# Altium schematic sheet Power.SchDoc
size A4; SheetNumber: 1; SheetTotal: 2
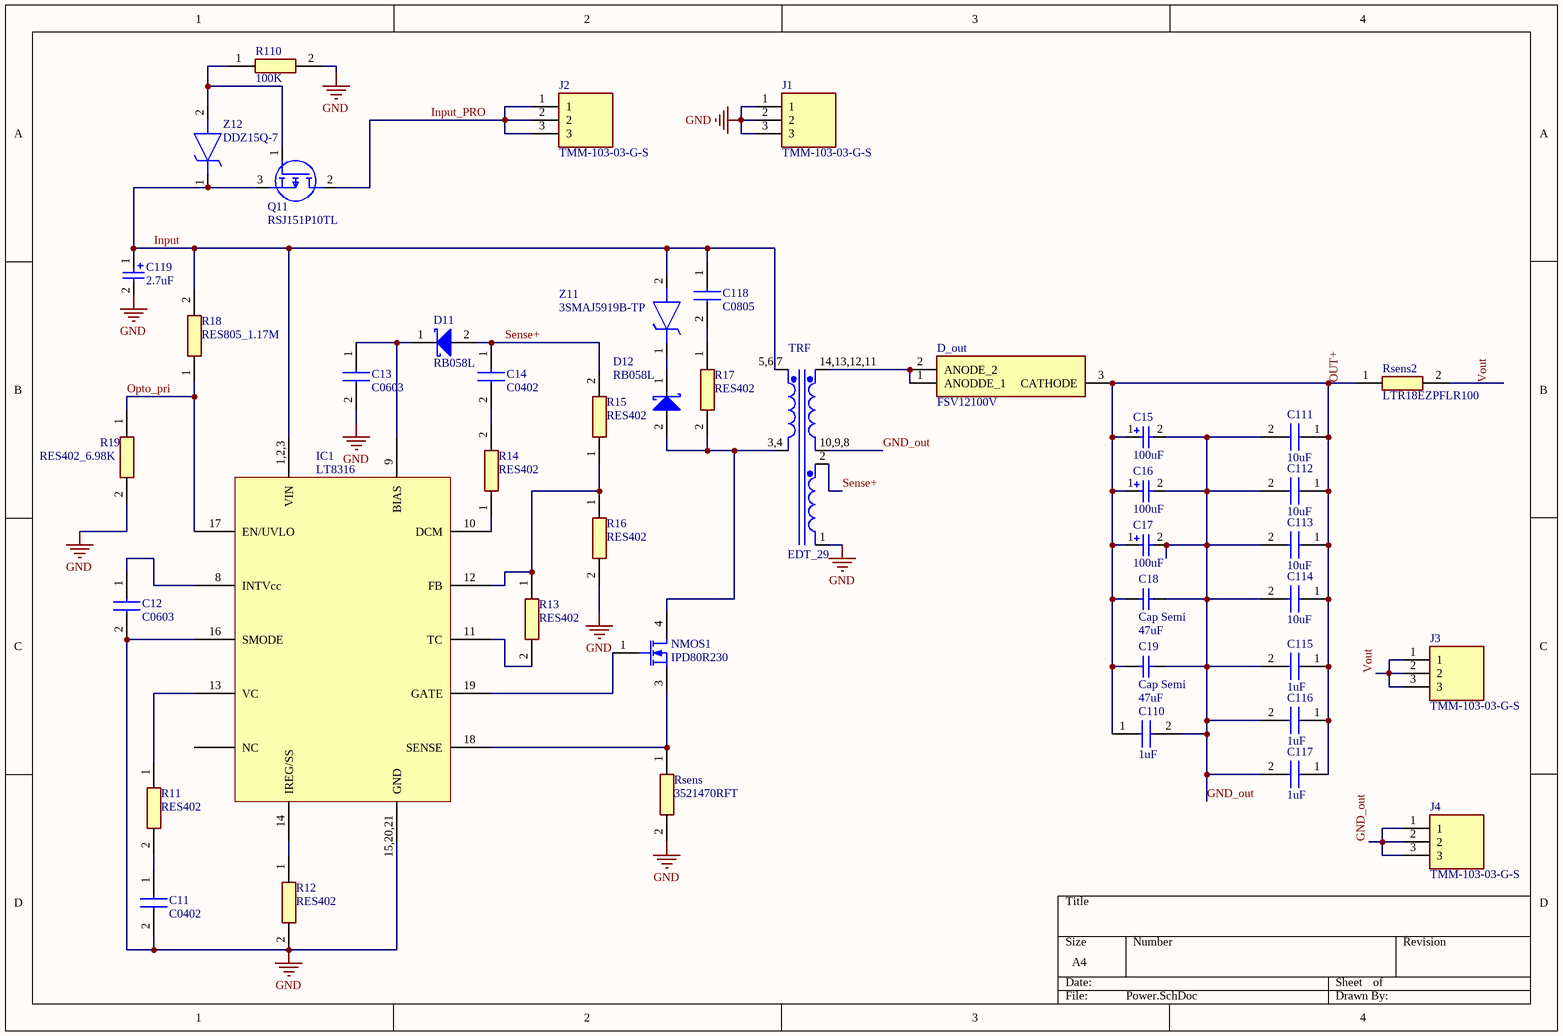
[diagram p0: Power.SchDoc]

## Parts
C11  C0402  [CAPC1005X55N]
C12  C0603  [CAPC1608X90N]
C13  C0603  [CAPC1608X90N]
C14  C0402  [CAPC1005X55N]
C15  100uF  [CAPAEDH107M016A9G]
C16  100uF  [CAPAEDH107M016A9G]
C17  100uF  [CAPAEDH107M016A9G]
C18  Cap Semi  value 47uF  [C1206]
C19  Cap Semi  value 47uF  [C1206]
C110  1uF  [CAPC1608X90N]
C111  10uF  [CAPC2012X145N]
C112  10uF  [CAPC2012X145N]
C113  10uF  [CAPC2012X145N]
C114  10uF  [CAPC2012X145N]
C115  1uF  [CAPC1608X90N]
C116  1uF  [CAPC1608X90N]
C117  1uF  [CAPC1608X90N]
C118  C0805  [CAPC2012X145N]
C119  2.7uF  [CAPAE127P600-8N]
D11  RB058L  [RB058L]
D12  RB058L  [RB058L]
D_out  FSV12100V  [FSV1045V]
IC1  LT8316  [TSOP65P640X120-20N]
J1  TMM-103-03-G-S  [HDRV3W50P0X200_1X3_600X197X550P]
J2  TMM-103-03-G-S  [HDRV3W50P0X200_1X3_600X197X550P]
J3  TMM-103-03-G-S  [HDRV3W50P0X200_1X3_600X197X550P]
J4  TMM-103-03-G-S  [HDRV3W50P0X200_1X3_600X197X550P]
NMOS1  IPD80R230  [DPAK228P994X241-3N]
Q11  RSJ151P10TL  [RSJ151P10TL]
R11  RES402  [ERJ2RKD1004X]
R12  RES402  [ERJ2RKD1004X]
R13  RES402  [ERJ2RKD1004X]
R14  RES402  [ERJ2RKD1004X]
R15  RES402  [ERJ2RKD1004X]
R16  RES402  [ERJ2RKD1004X]
R17  RES402  [ERJ2RKD1004X]
R18  RES805_1.17M  [RESC2012X50N]
R19  RES402_6.98K  [ERJ2RKD1004X]
R110  100K  [ERJ2RKD1004X]
Rsens  3521470RFT  [RESC6332X65N]
Rsens2  LTR18EZPFLR100  [RESC1632X68N]
TRF  EDT_29  [PCBComponent_1]
Z11  3SMAJ5919B-TP  [DIOM5226X244N]
Z12  DDZ15Q-7  [SOD3716X145N]

## Nets
GND: C11.2 C12.2 C13.2 C119.2(CAP-) IC1.15,20,21(GND) IC1.16(SMODE) J1.1 J1.2 J1.3 R12.2 R16.2 R19.2 R110.2 Rsens.2 TRF.1(Sec2-)
GND_out: C15.2(CAP-) C16.2(CAP-) C17.2(CAP-) C18.2 C19.2 C110.2 C111.2 C112.2 C113.2 C114.2 C115.2 C116.2 C117.2 J4.1 J4.2 J4.3 TRF.10,9,8(Sec1-)
Input: C118.1 C119.1(Cap+) IC1.1,2,3(VIN) Q11.3(S) R18.2 TRF.5,6,7(Pri+) Z11.2(A) Z12.1(K)
Input_PRO: J2.1 J2.2 J2.3 Q11.2(D)
Opto_pri: IC1.17(EN/UVLO) R18.1 R19.1
OUT+: C15.1(Cap+) C16.1(Cap+) C17.1(Cap+) C18.1 C19.1 C110.1 C111.1 C112.1 C113.1 C114.1 C115.1 C116.1 C117.1 D_out.3(CATHODE) Rsens2.1
Sense+: C14.1 D11.2(A) R15.2 TRF.2(Sec2+)
Vout: J3.1 J3.2 J3.3 Rsens2.2
NetC11_1: C11.1 R11.2
NetC12_1: C12.1 IC1.8(INTVcc)
NetC13_1: C13.1 D11.1(K) IC1.9(BIAS)
NetC14_2: C14.2 R14.2
NetC118_2: C118.2 R17.1
NetD12_1: D12.1(K) Z11.1(K)
NetD12_2: D12.2(A) NMOS1.4(D) R17.2 TRF.3,4(Pri-)
NetD_out_1: D_out.1(ANODDE_1) D_out.2(ANODE_2) TRF.14,13,12,11(Sec1+)
NetIC1_10: IC1.10(DCM) R14.1
NetIC1_11: IC1.11(TC) R13.2
NetIC1_12: IC1.12(FB) R13.1 R15.1 R16.1
NetIC1_13: IC1.13(VC) R11.1
NetIC1_14: IC1.14(IREG/SS) R12.1
NetIC1_18: IC1.18(SENSE) NMOS1.3(S) Rsens.1
NetIC1_19: IC1.19(GATE) NMOS1.1(G)
NetQ11_1: Q11.1(G) R110.1 Z12.2(A)

Not connected (* = marked no-connect by the designer): IC1 4,5,6,7(NC)

## Library data of the parts
C11 C14 = C0402C829D3GACTU: Capacitor; Manufacturer_Name: Kemet; Datasheet Link: https://content.kemet.com/datasheets/KEM_C1002_X7R_SMD.pdf; Height: 0.55mm; Manufacturer_Part_Number: C0402C829D3GACTU; Mouser Part Number: 80-C0402C829D3G; Mouser Price/Stock: https://www.mouser.co.uk/ProductDetail/KEMET/C0402C829D3GACTU?qs=ezuqA1hLDjkKgrGbHuNb0A%3D%3D; Arrow Part Number: C0402C829D3GACTU; Arrow Price/Stock: https://www.arrow.com/en/products/c0402c829d3gactu/kemet-corporation
C12 C13 C110 C115-C117 = CC0603KRX7R7BB103: Capacitor; Manufacturer_Name: YAGEO (PHYCOMP); Datasheet Link: http://www.yageo.com/documents/recent/UPY-GPHC_X7R_6.3V-to-50V_18.pdf; Height: 0.9mm; Manufacturer_Part_Number: CC0603KRX7R7BB103; Mouser Part Number: 603-CC603KRX7R7BB103; Mouser Price/Stock: https://www.mouser.co.uk/ProductDetail/Yageo/CC0603KRX7R7BB103?qs=5q%252BqlK8CmJRarFmz5k060w%3D%3D; Arrow Part Number: CC0603KRX7R7BB103; Arrow Price/Stock: https://www.arrow.com/en/products/cc0603krx7r7bb103/yageo
C15-C17 = CAPEDH107
C18 C19 = Cap Semi: Capacitor (Semiconductor SIM Model); Published: 8-Jun-2000; LatestRevisionDate: 29-May-2009; LatestRevisionNote: IPC-7351 Footprint Added.; PackageReference: C1206; Publisher: Altium Limited; PackageDescription: Chip Capacitor
C111-C114 C118 = GCG21BR71H154KA01K: Capacitor; Manufacturer_Name: Murata Electronics; Datasheet Link: https://psearch.en.murata.com/capacitor/product/GCG21BR71H154KA01%23.html; Height: 1.45mm; Manufacturer_Part_Number: GCG21BR71H154KA01K; Mouser Part Number: 81-GCG21BR71H154KA1K; Mouser Price/Stock: https://www.mouser.co.uk/ProductDetail/Murata-Electronics/GCG21BR71H154KA01K?qs=QzBtWTOodeWaaJ9cJuc7Gg%3D%3D; Arrow Part Number: GCG21BR71H154KA01K; Arrow Price/Stock: https://www.arrow.com/en/products/gcg21br71h154ka01k/murata-manufacturing
D_out = FSV12100V: Schottky Diode; Manufacturer_Name: ON Semiconductor; Datasheet Link: https://www.onsemi.com/pub/Collateral/FSV12100V-D.PDF; Height: 1.2mm; Manufacturer_Part_Number: FSV12100V; Mouser Part Number: 512-FSV12100V; Mouser Price/Stock: https://www.mouser.co.uk/ProductDetail/ON-Semiconductor-Fairchild/FSV12100V?qs=8Nc07tNByyHxUYQ9xyerWQ%3D%3D; Arrow Part Number: FSV12100V; Arrow Price/Stock: https://www.arrow.com/en/products/fsv12100v/on-semiconductor?region=nac
J1-J4 = TMM-103-03-G-S: Connector; Manufacturer_Name: SAMTEC; Datasheet Link: https://www.arrow.com/en/products/tmm-103-03-g-s/samtec; Height: 5.5mm; Manufacturer_Part_Number: TMM-103-03-G-S; Mouser Part Number: 200-TMM10303GS; Mouser Price/Stock: https://www.mouser.co.uk/ProductDetail/Samtec/TMM-103-03-G-S?qs=fnpEE5GccuM0dk34m8SAnQ%3D%3D; Arrow Part Number: TMM-103-03-G-S; Arrow Price/Stock: https://www.arrow.com/en/products/tmm-103-03-g-s/samtec
NMOS1 = IPD80R230: Power Mosfet
Q11 = RSJ151P10TL: MOSFET (P-Channel); Manufacturer_Name: ROHM Semiconductor; Datasheet Link: https://componentsearchengine.com/Datasheets/1/RSJ151P10TL.pdf; Height: 2mm; Manufacturer_Part_Number: RSJ151P10TL; Mouser Part Number: 755-RSJ151P10TL; Mouser Price/Stock: https://www.mouser.co.uk/ProductDetail/ROHM-Semiconductor/RSJ151P10TL?qs=npTsUczJOtN3pQwAwZe%252BkQ%3D%3D
R11-R17 R19 R110 = ERJ2RKF4023X: Resistor; Manufacturer_Name: Panasonic; Datasheet Link: http://docs-europe.electrocomponents.com/webdocs/13ba/0900766b813ba21b.pdf; Height: 0.4mm; Manufacturer_Part_Number: ERJ2RKF4023X
R18 = CRCW0805160RFKEA: Resistor; Manufacturer_Name: Vishay; Datasheet Link: http://www.vishay.com/docs/20035/dcrcwe3.pdf; Height: 0.5mm; Manufacturer_Part_Number: CRCW0805160RFKEA; Mouser Part Number: 71-CRCW0805160RFKEA; Mouser Price/Stock: https://www.mouser.co.uk/ProductDetail/Vishay-Dale/CRCW0805160RFKEA?qs=bMjB6bAaLENAK7tiR9oJIA%3D%3D; Arrow Part Number: CRCW0805160RFKEA; Arrow Price/Stock: https://www.arrow.com/en/products/crcw0805160rfkea/vishay
Rsens = 3521470RFT: Resistor; Manufacturer_Name: TE Connectivity; Datasheet Link: http://docs-emea.rs-online.com/webdocs/1096/0900766b81096b90.pdf; Height: 0.65mm; Manufacturer_Part_Number: 3521470RFT; Mouser Part Number: 279-3521470RFT; Mouser Price/Stock: https://www.mouser.com/Search/Refine.aspx?Keyword=279-3521470RFT; Arrow Part Number: 3521470RFT; Arrow Price/Stock: https://www.arrow.com/en/products/3521470rft/te-connectivity
Rsens2 = LTR18EZPFLR100: Resistor; Manufacturer_Name: ROHM Semiconductor; Datasheet Link: https://componentsearchengine.com/Datasheets/1/LTR18EZPFLR100.pdf; Height: 0.68mm; Manufacturer_Part_Number: LTR18EZPFLR100; Mouser Part Number: 755-LTR18EZPFLR100; Mouser Price/Stock: https://www.mouser.co.uk/ProductDetail/ROHM-Semiconductor/LTR18EZPFLR100?qs=493kPxzlxfIvjOOFIGs2zg%3D%3D
TRF = EDT_29: Transformer
Z11 = 3SMAJ5919B-TP: Zener Diode; Manufacturer_Name: Micro Commercial Components (MCC); Datasheet Link: https://componentsearchengine.com/Datasheets/1/3SMAJ5919B-TP.pdf; Height: 2.44mm; Manufacturer_Part_Number: 3SMAJ5919B-TP; Mouser Part Number: 833-3SMAJ5919B-TP; Mouser Price/Stock: https://www.mouser.co.uk/ProductDetail/Micro-Commercial-Components-MCC/3SMAJ5919B-TP?qs=ZNK0BnemlqFOug%252B1FuXOvQ%3D%3D; Arrow Part Number: 3SMAJ5919B-TP; Arrow Price/Stock: https://www.arrow.com/en/products/3smaj5919b-tp/micro-commercial-components
Z12 = DDZ15Q-7: Zener Diode; Manufacturer_Name: Diodes Inc.; Datasheet Link: https://www.diodes.com/assets/Datasheets/Ds30407.pdf; Height: 1.45mm; Manufacturer_Part_Number: DDZ15Q-7; Mouser Part Number: 621-DDZ15Q-7; Mouser Price/Stock: https://www.mouser.co.uk/ProductDetail/Diodes-Incorporated/DDZ15Q-7?qs=26fMNUst%2FUDpVXvTBmYYxg%3D%3D